# EAGLE schematic awsome-H-shifter (EAGLE 9.7.0)
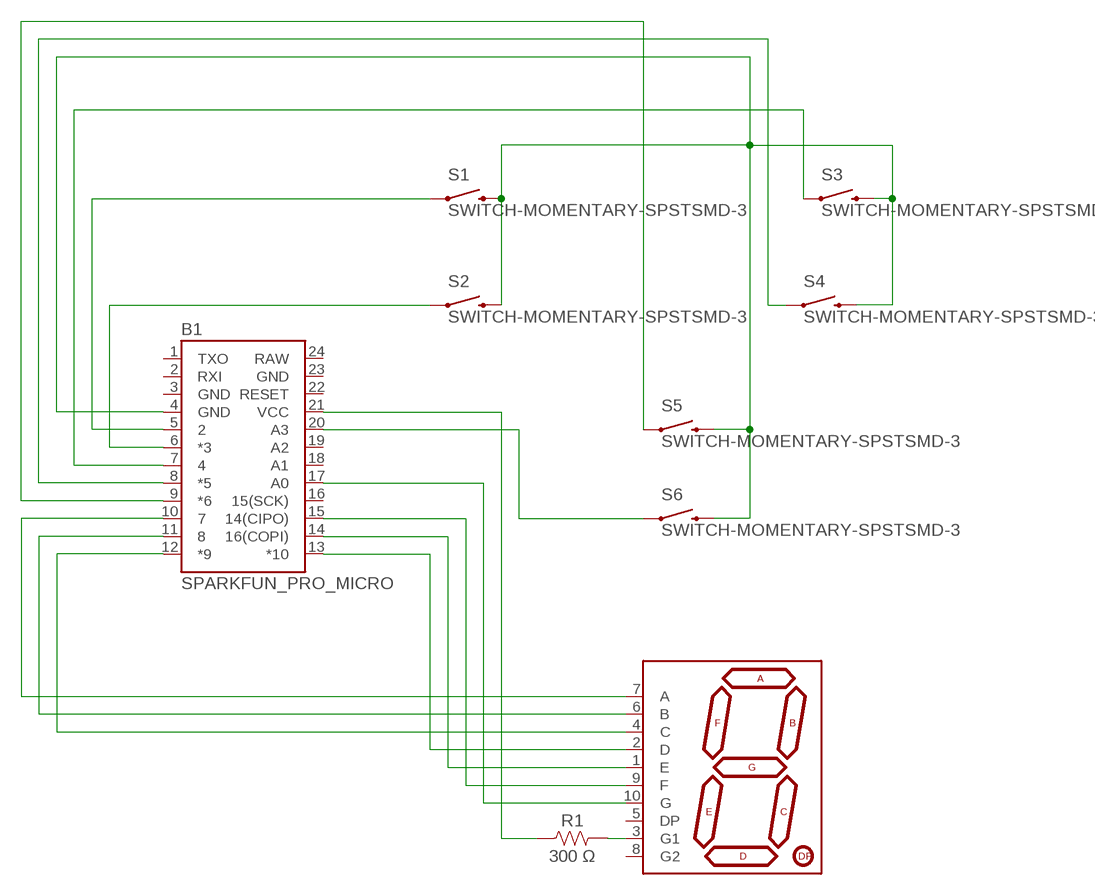
[diagram p0: schematic, sheet 1]

## Parts
B1  SPARKFUN_PRO_MICRO  [SPARKFUN_PRO_MICRO]
R1  300 Ω  R-US_CHIP-0402(1005-METRIC)  [RESC1005X40]
S1  SWITCH-MOMENTARY-SPSTSMD-3  [TACTILE_SWITCH_SMD-3]
S2  SWITCH-MOMENTARY-SPSTSMD-3  [TACTILE_SWITCH_SMD-3]
S3  SWITCH-MOMENTARY-SPSTSMD-3  [TACTILE_SWITCH_SMD-3]
S4  SWITCH-MOMENTARY-SPSTSMD-3  [TACTILE_SWITCH_SMD-3]
S5  SWITCH-MOMENTARY-SPSTSMD-3  [TACTILE_SWITCH_SMD-3]
S6  SWITCH-MOMENTARY-SPSTSMD-3  [TACTILE_SWITCH_SMD-3]
U$1  7-SEGMENT-DISPLAYPTH  [7-SEGMENT-DISPLAY]

## Nets
N$1: B1.4(GND) S1.4 S2.4 S3.4 S4.4 S5.4 S6.4
N$2: B1.5 S1.1
N$3: B1.6(*3) S2.1
N$4: B1.7 S3.1
N$5: B1.8(*5) S4.1
N$6: B1.9(*6) S5.1
N$7: B1.10 U$1.7(A)
N$8: B1.11 U$1.6(B)
N$9: B1.12(*9) U$1.4(C)
N$10: B1.13(*10) U$1.2(D)
N$11: B1.14(16(COPI)) U$1.1(E)
N$12: B1.15(14(CIPO)) U$1.9(F)
N$13: B1.17(A0) U$1.10(G)
N$14: B1.21(VCC) R1.1
N$15: B1.20(A3) S6.1
N$16: R1.2 U$1.3(G1)
Unconnected: B1.1(TXO) B1.2(RXI) B1.16(15(SCK)) B1.18(A1) B1.19(A2) B1.22(RESET) U$1.5(DP) U$1.8(G2)

## Power pins joined to a net without a drawn wire
GND: B1.3(GND) B1.23(GND)
RAW: B1.24(RAW)

## Library data of the parts
B1 = SparkFun-Boards:SPARKFUN_PRO_MICRO: SparkFun Pro Micro Atmega32U4 compatible footprint. SparkFun Products: 3.3V/8MHz <https://www.sparkfun.com/products/12587> 5V/16MHz <https://www.sparkfun.com/products/12640>
R1 = Resistor:R-US: Resistor Fixed - ANSI; CATEGORY: Resistors; DESCRIPTION: Chip Resistor 1.05 X 0.54 X 0.40 mm body 0402(1005-METRIC) Package; PACKAGE_SIZE: 0402; PACKAGE_TYPE: Surface Mount
S1-S6 = SparkFun-Retired:SWITCH-MOMENTARY-SPST: Various NO switches- pushbuttons, reed, etc
U$1 = SparkFun-Retired:7-SEGMENT-DISPLAY